# Altium project pdmlse_pcb.PrjPcb (part 4 of 4)

## Sheet Intel16_UNI3.SchDoc
size A4; SheetNumber: 7; SheetTotal: 15
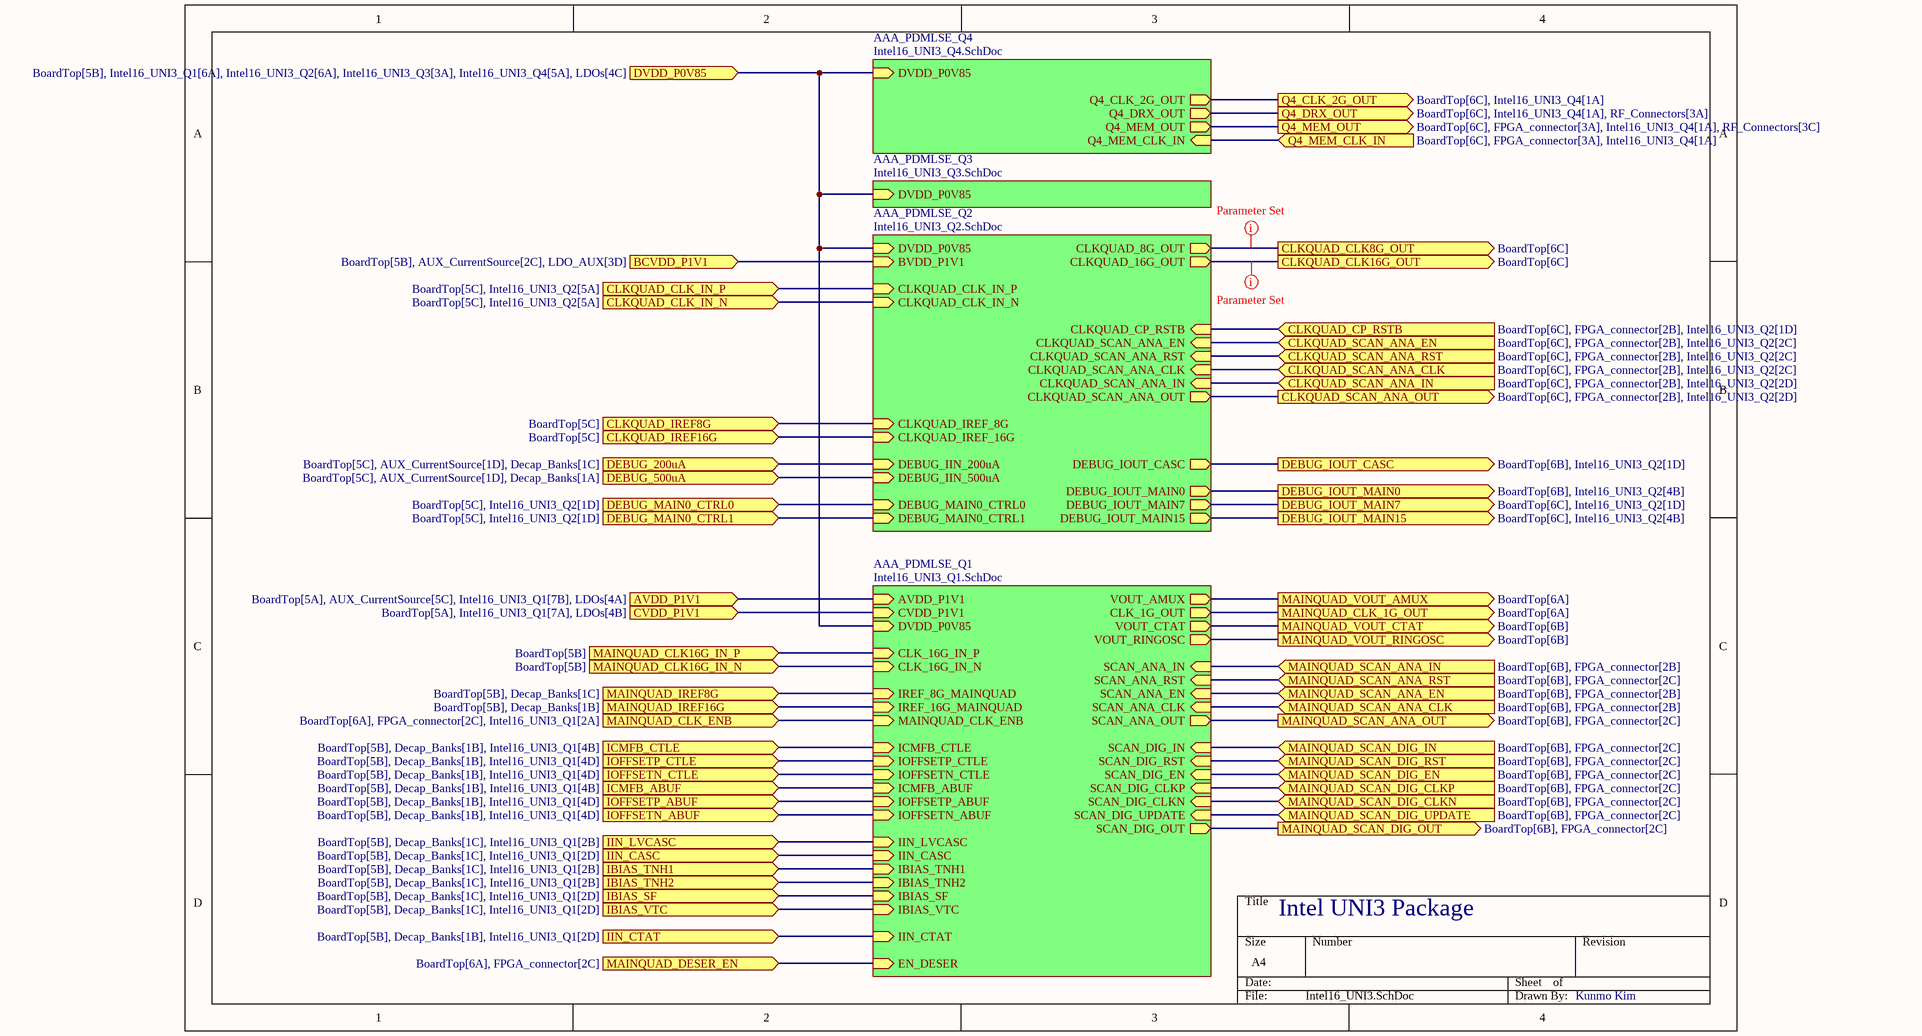
[diagram p8: Intel16_UNI3.SchDoc]

### Sub-sheets
AAA_PDMLSE_Q1 = Intel16_UNI3_Q1.SchDoc (file not in this document): CLK_16G_IN_P (in), DVDD_P0V85 (in), CVDD_P1V1 (in), CLK_16G_IN_N (in), MAINQUAD_CLK_ENB (in), IREF_8G_MAINQUAD (in), IREF_16G_MAINQUAD (in), IBIAS_TNH2 (in), ICMFB_ABUF (in), AVDD_P1V1 (in), IBIAS_TNH1 (in), ICMFB_CTLE (in), IIN_LVCASC (in), SCAN_DIG_OUT (out), SCAN_DIG_UPDATE (in), SCAN_DIG_EN (in), SCAN_DIG_RST (in), SCAN_DIG_CLKP (in), SCAN_DIG_CLKN (in), SCAN_DIG_IN (in), SCAN_ANA_OUT (out), SCAN_ANA_RST (in), SCAN_ANA_IN (in), SCAN_ANA_EN (in), SCAN_ANA_CLK (in), EN_DESER (in), VOUT_RINGOSC (out), IIN_CASC (in), CLK_1G_OUT (out), IIN_CTAT (in), VOUT_AMUX (out), VOUT_CTAT (out), IBIAS_SF (in), IOFFSETP_CTLE (in), IBIAS_VTC (in), IOFFSETN_CTLE (in), IOFFSETN_ABUF (in), IOFFSETP_ABUF (in)
AAA_PDMLSE_Q2 = Intel16_UNI3_Q2.SchDoc (file not in this document): DVDD_P0V85 (in), BVDD_P1V1 (in), CLKQUAD_8G_OUT (out), CLKQUAD_16G_OUT (out), CLKQUAD_CLK_IN_N (in), CLKQUAD_CLK_IN_P (in), CLKQUAD_SCAN_ANA_CLK (in), CLKQUAD_SCAN_ANA_RST (in), CLKQUAD_SCAN_ANA_EN (in), CLKQUAD_SCAN_ANA_OUT (out), CLKQUAD_SCAN_ANA_IN (in), CLKQUAD_IREF_8G (in), CLKQUAD_CP_RSTB (in), CLKQUAD_IREF_16G (in), DEBUG_IIN_200uA (in), DEBUG_IIN_500uA (in), DEBUG_MAIN0_CTRL0 (in), DEBUG_MAIN0_CTRL1 (in), DEBUG_IOUT_CASC (out), DEBUG_IOUT_MAIN7 (out), DEBUG_IOUT_MAIN15 (out), DEBUG_IOUT_MAIN0 (out)
AAA_PDMLSE_Q3 = Intel16_UNI3_Q3.SchDoc (file not in this document): DVDD_P0V85 (in)
AAA_PDMLSE_Q4 = Intel16_UNI3_Q4.SchDoc (file not in this document): DVDD_P0V85 (in), Q4_CLK_2G_OUT (out), Q4_DRX_OUT (out), Q4_MEM_OUT (out), Q4_MEM_CLK_IN (in)

### Ports
AVDD_P1V1 (in, see BoardTop[5A], AUX_CurrentSource[5C], Intel16_UNI3_Q1[7B], LDOs[4A]), BCVDD_P1V1 (in, see BoardTop[5B], AUX_CurrentSource[2C], LDO_AUX[3D]), CLKQUAD_CLK8G_OUT (out, see BoardTop[6C]), CLKQUAD_CLK16G_OUT (out, see BoardTop[6C]), CLKQUAD_CLK_IN_N (in, see BoardTop[5C], Intel16_UNI3_Q2[5A]), CLKQUAD_CLK_IN_P (in, see BoardTop[5C], Intel16_UNI3_Q2[5A]), CLKQUAD_CP_RSTB (in, see BoardTop[6C], FPGA_connector[2B], Intel16_UNI3_Q2[1D]), CLKQUAD_IREF8G (in, see BoardTop[5C]), CLKQUAD_IREF16G (in, see BoardTop[5C]), CLKQUAD_SCAN_ANA_CLK (in, see BoardTop[6C], FPGA_connector[2B], Intel16_UNI3_Q2[2C]), CLKQUAD_SCAN_ANA_EN (in, see BoardTop[6C], FPGA_connector[2B], Intel16_UNI3_Q2[2C]), CLKQUAD_SCAN_ANA_IN (in, see BoardTop[6C], FPGA_connector[2B], Intel16_UNI3_Q2[2D]), CLKQUAD_SCAN_ANA_OUT (out, see BoardTop[6C], FPGA_connector[2B], Intel16_UNI3_Q2[2D]), CLKQUAD_SCAN_ANA_RST (in, see BoardTop[6C], FPGA_connector[2B], Intel16_UNI3_Q2[2C]), CVDD_P1V1 (in, see BoardTop[5A], Intel16_UNI3_Q1[7A], LDOs[4B]), DEBUG_200uA (in, see BoardTop[5C], AUX_CurrentSource[1D], Decap_Banks[1C]), DEBUG_500uA (in, see BoardTop[5C], AUX_CurrentSource[1D], Decap_Banks[1A]), DEBUG_IOUT_CASC (out, see BoardTop[6B], Intel16_UNI3_Q2[1D]), DEBUG_IOUT_MAIN0 (out, see BoardTop[6B], Intel16_UNI3_Q2[4B]), DEBUG_IOUT_MAIN7 (out, see BoardTop[6C], Intel16_UNI3_Q2[1D]), DEBUG_IOUT_MAIN15 (out, see BoardTop[6C], Intel16_UNI3_Q2[4B]), DEBUG_MAIN0_CTRL0 (in, see BoardTop[5C], Intel16_UNI3_Q2[1D]), DEBUG_MAIN0_CTRL1 (in, see BoardTop[5C], Intel16_UNI3_Q2[1D]), DVDD_P0V85 (in, see BoardTop[5B], Intel16_UNI3_Q1[6A], Intel16_UNI3_Q2[6A], Intel16_UNI3_Q3[3A], Intel16_UNI3_Q4[5A], LDOs[4C]), IBIAS_SF (in, see BoardTop[5B], Decap_Banks[1C], Intel16_UNI3_Q1[2D]), IBIAS_TNH1 (in, see BoardTop[5B], Decap_Banks[1C], Intel16_UNI3_Q1[2B]), IBIAS_TNH2 (in, see BoardTop[5B], Decap_Banks[1C], Intel16_UNI3_Q1[2B]), IBIAS_VTC (in, see BoardTop[5B], Decap_Banks[1C], Intel16_UNI3_Q1[2D]), ICMFB_ABUF (in, see BoardTop[5B], Decap_Banks[1B], Intel16_UNI3_Q1[4B]), ICMFB_CTLE (in, see BoardTop[5B], Decap_Banks[1B], Intel16_UNI3_Q1[4B]), IIN_CASC (in, see BoardTop[5B], Decap_Banks[1C], Intel16_UNI3_Q1[2D]), IIN_CTAT (in, see BoardTop[5B], Decap_Banks[1B], Intel16_UNI3_Q1[2D]), IIN_LVCASC (in, see BoardTop[5B], Decap_Banks[1C], Intel16_UNI3_Q1[2B]), IOFFSETN_ABUF (in, see BoardTop[5B], Decap_Banks[1B], Intel16_UNI3_Q1[4D]), IOFFSETN_CTLE (in, see BoardTop[5B], Decap_Banks[1B], Intel16_UNI3_Q1[4D]), IOFFSETP_ABUF (in, see BoardTop[5B], Decap_Banks[1B], Intel16_UNI3_Q1[4D]), IOFFSETP_CTLE (in, see BoardTop[5B], Decap_Banks[1B], Intel16_UNI3_Q1[4D]), MAINQUAD_CLK16G_IN_N (in, see BoardTop[5B]), MAINQUAD_CLK16G_IN_P (in, see BoardTop[5B]), MAINQUAD_CLK_1G_OUT (out, see BoardTop[6A]), MAINQUAD_CLK_ENB (in, see BoardTop[6A], FPGA_connector[2C], Intel16_UNI3_Q1[2A]), MAINQUAD_DESER_EN (in, see BoardTop[6A], FPGA_connector[2C]), MAINQUAD_IREF8G (in, see BoardTop[5B], Decap_Banks[1C]), MAINQUAD_IREF16G (in, see BoardTop[5B], Decap_Banks[1B]), MAINQUAD_SCAN_ANA_CLK (in, see BoardTop[6B], FPGA_connector[2B]), MAINQUAD_SCAN_ANA_EN (in, see BoardTop[6B], FPGA_connector[2B]), MAINQUAD_SCAN_ANA_IN (in, see BoardTop[6B], FPGA_connector[2B]), MAINQUAD_SCAN_ANA_OUT (out, see BoardTop[6B], FPGA_connector[2C]), MAINQUAD_SCAN_ANA_RST (in, see BoardTop[6B], FPGA_connector[2C]), MAINQUAD_SCAN_DIG_CLKN (in, see BoardTop[6B], FPGA_connector[2C]), MAINQUAD_SCAN_DIG_CLKP (in, see BoardTop[6B], FPGA_connector[2C]), MAINQUAD_SCAN_DIG_EN (in, see BoardTop[6B], FPGA_connector[2C]), MAINQUAD_SCAN_DIG_IN (in, see BoardTop[6B], FPGA_connector[2C]), MAINQUAD_SCAN_DIG_OUT (out, see BoardTop[6B], FPGA_connector[2C]), MAINQUAD_SCAN_DIG_RST (in, see BoardTop[6B], FPGA_connector[2C]), MAINQUAD_SCAN_DIG_UPDATE (in, see BoardTop[6B], FPGA_connector[2C]), MAINQUAD_VOUT_AMUX (out, see BoardTop[6A]), MAINQUAD_VOUT_CTAT (out, see BoardTop[6B]), MAINQUAD_VOUT_RINGOSC (out, see BoardTop[6B]), Q4_CLK_2G_OUT (out, see BoardTop[6C], Intel16_UNI3_Q4[1A]), Q4_DRX_OUT (out, see BoardTop[6C], Intel16_UNI3_Q4[1A], RF_Connectors[3A]), Q4_MEM_CLK_IN (in, see BoardTop[6C], FPGA_connector[3A], Intel16_UNI3_Q4[1A]), Q4_MEM_OUT (out, see BoardTop[6C], FPGA_connector[3A], Intel16_UNI3_Q4[1A], RF_Connectors[3C])

### Nets
AVDD_P1V1: port AVDD_P1V1, sheet AAA_PDMLSE_Q1/AVDD_P1V1
CVDD_P1V1: port CVDD_P1V1, sheet AAA_PDMLSE_Q1/CVDD_P1V1
DVDD_P0V85: port DVDD_P0V85, sheet AAA_PDMLSE_Q4/DVDD_P0V85, sheet AAA_PDMLSE_Q3/DVDD_P0V85, sheet AAA_PDMLSE_Q1/DVDD_P0V85, sheet AAA_PDMLSE_Q2/DVDD_P0V85
BCVDD_P1V1: port BCVDD_P1V1, sheet AAA_PDMLSE_Q2/BVDD_P1V1
CLKQUAD_SCAN_ANA_CLK: port CLKQUAD_SCAN_ANA_CLK, sheet AAA_PDMLSE_Q2/CLKQUAD_SCAN_ANA_CLK
CLKQUAD_SCAN_ANA_EN: port CLKQUAD_SCAN_ANA_EN, sheet AAA_PDMLSE_Q2/CLKQUAD_SCAN_ANA_EN
CLKQUAD_SCAN_ANA_IN: port CLKQUAD_SCAN_ANA_IN, sheet AAA_PDMLSE_Q2/CLKQUAD_SCAN_ANA_IN
CLKQUAD_SCAN_ANA_OUT: port CLKQUAD_SCAN_ANA_OUT, sheet AAA_PDMLSE_Q2/CLKQUAD_SCAN_ANA_OUT
CLKQUAD_SCAN_ANA_RST: port CLKQUAD_SCAN_ANA_RST, sheet AAA_PDMLSE_Q2/CLKQUAD_SCAN_ANA_RST
DEBUG_200uA: port DEBUG_200uA, sheet AAA_PDMLSE_Q2/DEBUG_IIN_200uA
DEBUG_500uA: port DEBUG_500uA, sheet AAA_PDMLSE_Q2/DEBUG_IIN_500uA
DEBUG_MAIN0_CTRL0: port DEBUG_MAIN0_CTRL0, sheet AAA_PDMLSE_Q2/DEBUG_MAIN0_CTRL0
DEBUG_MAIN0_CTRL1: port DEBUG_MAIN0_CTRL1, sheet AAA_PDMLSE_Q2/DEBUG_MAIN0_CTRL1
EN_DESER: port MAINQUAD_DESER_EN, sheet AAA_PDMLSE_Q1/EN_DESER
ENB_CLK: port MAINQUAD_CLK_ENB, sheet AAA_PDMLSE_Q1/MAINQUAD_CLK_ENB
IBIAS_SF: port IBIAS_SF, sheet AAA_PDMLSE_Q1/IBIAS_SF
IBIAS_TNH1: port IBIAS_TNH1, sheet AAA_PDMLSE_Q1/IBIAS_TNH1
IBIAS_TNH2: port IBIAS_TNH2, sheet AAA_PDMLSE_Q1/IBIAS_TNH2
IBIAS_VTC: port IBIAS_VTC, sheet AAA_PDMLSE_Q1/IBIAS_VTC
ICMFB_ABUF: port ICMFB_ABUF, sheet AAA_PDMLSE_Q1/ICMFB_ABUF
ICMFB_CTLE: port ICMFB_CTLE, sheet AAA_PDMLSE_Q1/ICMFB_CTLE
IIN_CASC: port IIN_CASC, sheet AAA_PDMLSE_Q1/IIN_CASC
IIN_CTAT: port IIN_CTAT, sheet AAA_PDMLSE_Q1/IIN_CTAT
IIN_LVCASC: port IIN_LVCASC, sheet AAA_PDMLSE_Q1/IIN_LVCASC
IOFFSETN_ABUF: port IOFFSETN_ABUF, sheet AAA_PDMLSE_Q1/IOFFSETN_ABUF
IOFFSETN_CTLE: port IOFFSETN_CTLE, sheet AAA_PDMLSE_Q1/IOFFSETN_CTLE
IOFFSETP_ABUF: port IOFFSETP_ABUF, sheet AAA_PDMLSE_Q1/IOFFSETP_ABUF
IOFFSETP_CTLE: port IOFFSETP_CTLE, sheet AAA_PDMLSE_Q1/IOFFSETP_CTLE
MAINQUAD_IREF8G: port MAINQUAD_IREF8G, sheet AAA_PDMLSE_Q1/IREF_8G_MAINQUAD
MAINQUAD_IREF16G: port MAINQUAD_IREF16G, sheet AAA_PDMLSE_Q1/IREF_16G_MAINQUAD
MAINQUAD_SCAN_ANA_CLK: port MAINQUAD_SCAN_ANA_CLK, sheet AAA_PDMLSE_Q1/SCAN_ANA_CLK
MAINQUAD_SCAN_ANA_EN: port MAINQUAD_SCAN_ANA_EN, sheet AAA_PDMLSE_Q1/SCAN_ANA_EN
MAINQUAD_SCAN_ANA_IN: port MAINQUAD_SCAN_ANA_IN, sheet AAA_PDMLSE_Q1/SCAN_ANA_IN
MAINQUAD_SCAN_ANA_OUT: port MAINQUAD_SCAN_ANA_OUT, sheet AAA_PDMLSE_Q1/SCAN_ANA_OUT
MAINQUAD_SCAN_ANA_RST: port MAINQUAD_SCAN_ANA_RST, sheet AAA_PDMLSE_Q1/SCAN_ANA_RST
MAINQUAD_SCAN_DIG_CLKN: port MAINQUAD_SCAN_DIG_CLKN, sheet AAA_PDMLSE_Q1/SCAN_DIG_CLKN
MAINQUAD_SCAN_DIG_CLKP: port MAINQUAD_SCAN_DIG_CLKP, sheet AAA_PDMLSE_Q1/SCAN_DIG_CLKP
MAINQUAD_SCAN_DIG_EN: port MAINQUAD_SCAN_DIG_EN, sheet AAA_PDMLSE_Q1/SCAN_DIG_EN
MAINQUAD_SCAN_DIG_IN: port MAINQUAD_SCAN_DIG_IN, sheet AAA_PDMLSE_Q1/SCAN_DIG_IN
MAINQUAD_SCAN_DIG_OUT: port MAINQUAD_SCAN_DIG_OUT, sheet AAA_PDMLSE_Q1/SCAN_DIG_OUT
MAINQUAD_SCAN_DIG_RST: port MAINQUAD_SCAN_DIG_RST, sheet AAA_PDMLSE_Q1/SCAN_DIG_RST
MAINQUAD_SCAN_DIG_UPDATE: port MAINQUAD_SCAN_DIG_UPDATE, sheet AAA_PDMLSE_Q1/SCAN_DIG_UPDATE
Q4_CLK_2G_OUT: port Q4_CLK_2G_OUT, sheet AAA_PDMLSE_Q4/Q4_CLK_2G_OUT
Q4_DRX_OUT: port Q4_DRX_OUT, sheet AAA_PDMLSE_Q4/Q4_DRX_OUT
Q4_MEM_CLK: port Q4_MEM_CLK_IN, sheet AAA_PDMLSE_Q4/Q4_MEM_CLK_IN
Q4_MEM_OUT: port Q4_MEM_OUT, sheet AAA_PDMLSE_Q4/Q4_MEM_OUT
SIG_AMUX: port MAINQUAD_VOUT_AMUX, sheet AAA_PDMLSE_Q1/VOUT_AMUX
SIG_CTAT: port MAINQUAD_VOUT_CTAT, sheet AAA_PDMLSE_Q1/VOUT_CTAT
NetC1_0_1: port MAINQUAD_CLK_1G_OUT, sheet AAA_PDMLSE_Q1/CLK_1G_OUT
NetC2_0_1: port MAINQUAD_VOUT_RINGOSC, sheet AAA_PDMLSE_Q1/VOUT_RINGOSC
NetC3_0_2: port CLKQUAD_CLK8G_OUT, sheet AAA_PDMLSE_Q2/CLKQUAD_8G_OUT
NetC4_0_2: port CLKQUAD_CLK16G_OUT, sheet AAA_PDMLSE_Q2/CLKQUAD_16G_OUT
NetC_CLKN_AA_CLK_16G_2: port MAINQUAD_CLK16G_IN_N, sheet AAA_PDMLSE_Q1/CLK_16G_IN_N
NetC_CLKN_AA_CLKQUAD_16G_2: port CLKQUAD_CLK_IN_P, sheet AAA_PDMLSE_Q2/CLKQUAD_CLK_IN_P
NetC_CLKP_AA_CLK_16G_2: port MAINQUAD_CLK16G_IN_P, sheet AAA_PDMLSE_Q1/CLK_16G_IN_P
NetC_CLKP_AA_CLKQUAD_16G_2: port CLKQUAD_CLK_IN_N, sheet AAA_PDMLSE_Q2/CLKQUAD_CLK_IN_N
NetCR3_12_1: port CLKQUAD_CP_RSTB, sheet AAA_PDMLSE_Q2/CLKQUAD_CP_RSTB
NetR1_0_1: port DEBUG_IOUT_CASC, sheet AAA_PDMLSE_Q2/DEBUG_IOUT_CASC
NetR2_0_1: port DEBUG_IOUT_MAIN7, sheet AAA_PDMLSE_Q2/DEBUG_IOUT_MAIN7
NetR3_0_1: port DEBUG_IOUT_MAIN0, sheet AAA_PDMLSE_Q2/DEBUG_IOUT_MAIN0
NetR4_0_1: port DEBUG_IOUT_MAIN15, sheet AAA_PDMLSE_Q2/DEBUG_IOUT_MAIN15
NetR5_0_2: port CLKQUAD_IREF16G, sheet AAA_PDMLSE_Q2/CLKQUAD_IREF_16G
NetR6_0_2: port CLKQUAD_IREF8G, sheet AAA_PDMLSE_Q2/CLKQUAD_IREF_8G

### Layout directives
net class SC50_Ver2: NetC3_0_2, NetC4_0_2

### Notes on the sheet
- Intel UNI3 Package
- Kunmo Kim

## Sheet CLK_16GHz.SchDoc
size A4; SheetNumber: 6; SheetTotal: 15
Used 2 times, as channels AA_CLK_16G, AA_CLKQUAD_16G. Parts and nets are listed once, with the designators drawn on the sheet.
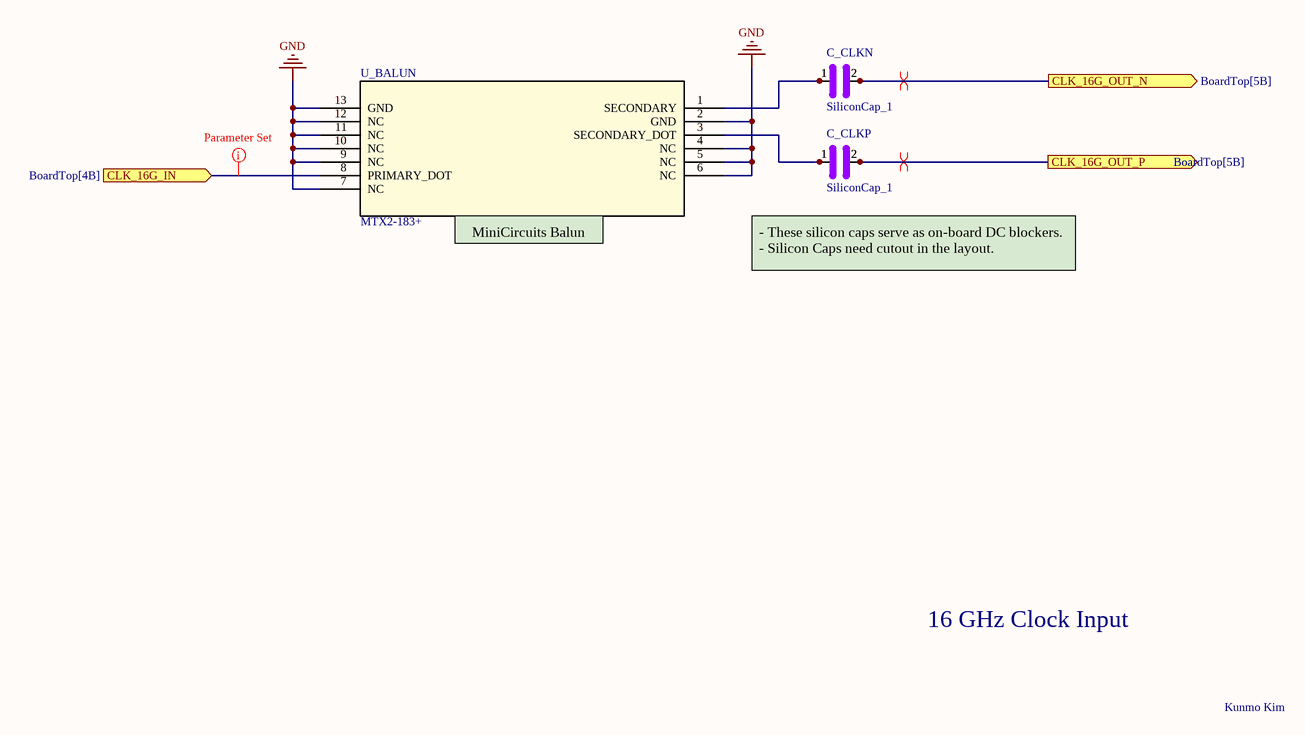
[diagram p9: CLK_16GHz.SchDoc]

### Parts
C_CLKN  SiliconCap_1  [0201-NOSILK]
C_CLKP  SiliconCap_1  [0201-NOSILK]
U_BALUN  MTX2-183+  [DG3006_MNC]

### Ports
CLK_16G_IN (in, see BoardTop[4B]), CLK_16G_OUT_N (out, see BoardTop[5B]), CLK_16G_OUT_P (out, see BoardTop[5B])

### Nets
GND: U_BALUN.2(GND) U_BALUN.4(NC) U_BALUN.5(NC) U_BALUN.6(NC) U_BALUN.7(NC) U_BALUN.9(NC) U_BALUN.10(NC) U_BALUN.11(NC) U_BALUN.12(NC) U_BALUN.13(GND)
CLK_16G_IN: U_BALUN.8(PRIMARY_DOT) ; port CLK_16G_IN
CLK_16G_OUT_N: C_CLKN.2 ; port CLK_16G_OUT_N
CLK_16G_OUT_P: C_CLKP.2 ; port CLK_16G_OUT_P
NetC_CLKN_1: C_CLKN.1 U_BALUN.1(SECONDARY)
NetC_CLKP_1: C_CLKP.1 U_BALUN.3(SECONDARY_DOT)

### Channels
AA_CLK_16G: designators end in _AA_CLK_16G; ports CLK_16G_IN=MAINQUAD_CLKIN CLK_16G_OUT_N=NetC_CLKN_AA_CLK_16G_2 CLK_16G_OUT_P=NetC_CLKP_AA_CLK_16G_2
AA_CLKQUAD_16G: designators end in _AA_CLKQUAD_16G; ports CLK_16G_IN=CLKQUAD_CLKIN CLK_16G_OUT_N=NetC_CLKN_AA_CLKQUAD_16G_2 CLK_16G_OUT_P=NetC_CLKP_AA_CLKQUAD_16G_2

### Layout directives
differential pair; differential pair class DIFF100; net class DIFF_CLK: NetC_CLKN_AA_CLK_16G_2, NetC_CLKP_AA_CLK_16G_2
net class SC50: MAINQUAD_CLKIN

### Notes on the sheet
- (near U_BALUN) MiniCircuits Balun
- - These silicon caps serve as on-board DC blockers.
  - Silicon Caps need cutout in the layout.
- 16 GHz Clock Input
- Kunmo Kim

### Library data of the parts
C_CLKN C_CLKP = SiliconCap_1: 939114492510-T3S from Murata; Supplier 1: Digikey; Supplier Part Number 1: 490-939114492510-T3SCT-ND
U_BALUN = MTX2-133+: Mfr_Name: Mini Circuits; RefDes: RefDes; Type: Type; Supplier 1: Mouser; Supplier Part Number 1: 139-MTX2-183+

## Sheet Decap_Banks.SchDoc
size A4; SheetNumber: 12; SheetTotal: 15
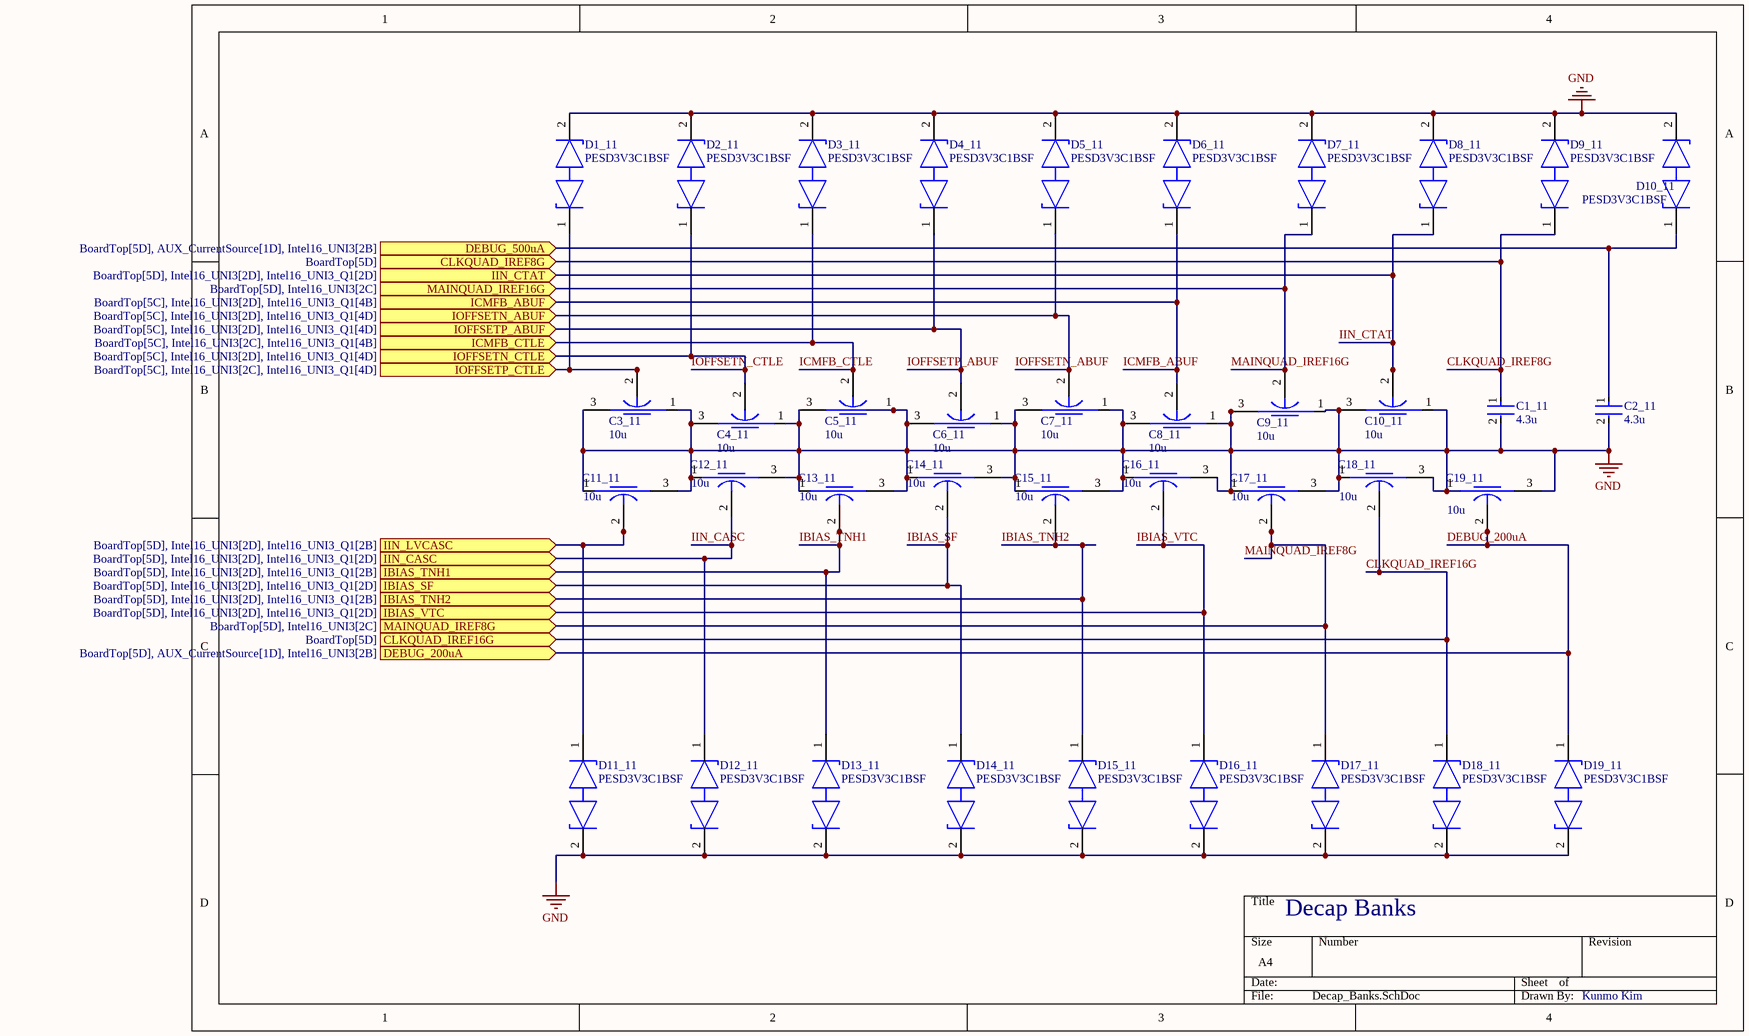
[diagram p10: Decap_Banks.SchDoc]

### Parts
C1_11  4.3u  [FP-LLL1U4-0_05-IPC_C]
C2_11  4.3u  [FP-LLL1U4-0_05-IPC_C]
C3_11  10u  [FP-NFM15-0_2-MFG]
C4_11  10u  [FP-NFM15-0_2-MFG]
C5_11  10u  [FP-NFM15-0_2-MFG]
C6_11  10u  [FP-NFM15-0_2-MFG]
C7_11  10u  [FP-NFM15-0_2-MFG]
C8_11  10u  [FP-NFM15-0_2-MFG]
C9_11  10u  [FP-NFM15-0_2-MFG]
C10_11  10u  [FP-NFM15-0_2-MFG]
C11_11  10u  [FP-NFM15-0_2-MFG]
C12_11  10u  [FP-NFM15-0_2-MFG]
C13_11  10u  [FP-NFM15-0_2-MFG]
C14_11  10u  [FP-NFM15-0_2-MFG]
C15_11  10u  [FP-NFM15-0_2-MFG]
C16_11  10u  [FP-NFM15-0_2-MFG]
C17_11  10u  [FP-NFM15-0_2-MFG]
C18_11  10u  [FP-NFM15-0_2-MFG]
C19_11  10u  [FP-NFM15-0_2-MFG]
D1_11  PESD3V3C1BSF  [FP-SOD962-2-MFG]
D2_11  PESD3V3C1BSF  [FP-SOD962-2-MFG]
D3_11  PESD3V3C1BSF  [FP-SOD962-2-MFG]
D4_11  PESD3V3C1BSF  [FP-SOD962-2-MFG]
D5_11  PESD3V3C1BSF  [FP-SOD962-2-MFG]
D6_11  PESD3V3C1BSF  [FP-SOD962-2-MFG]
D7_11  PESD3V3C1BSF  [FP-SOD962-2-MFG]
D8_11  PESD3V3C1BSF  [FP-SOD962-2-MFG]
D9_11  PESD3V3C1BSF  [FP-SOD962-2-MFG]
D10_11  PESD3V3C1BSF  [FP-SOD962-2-MFG]
D11_11  PESD3V3C1BSF  [FP-SOD962-2-MFG]
D12_11  PESD3V3C1BSF  [FP-SOD962-2-MFG]
D13_11  PESD3V3C1BSF  [FP-SOD962-2-MFG]
D14_11  PESD3V3C1BSF  [FP-SOD962-2-MFG]
D15_11  PESD3V3C1BSF  [FP-SOD962-2-MFG]
D16_11  PESD3V3C1BSF  [FP-SOD962-2-MFG]
D17_11  PESD3V3C1BSF  [FP-SOD962-2-MFG]
D18_11  PESD3V3C1BSF  [FP-SOD962-2-MFG]
D19_11  PESD3V3C1BSF  [FP-SOD962-2-MFG]

### Ports
CLKQUAD_IREF8G (in, see BoardTop[5D]), CLKQUAD_IREF16G (in, see BoardTop[5D]), DEBUG_200uA (in, see BoardTop[5D], AUX_CurrentSource[1D], Intel16_UNI3[2B]), DEBUG_500uA (in, see BoardTop[5D], AUX_CurrentSource[1D], Intel16_UNI3[2B]), IBIAS_SF (in, see BoardTop[5D], Intel16_UNI3[2D], Intel16_UNI3_Q1[2D]), IBIAS_TNH1 (in, see BoardTop[5D], Intel16_UNI3[2D], Intel16_UNI3_Q1[2B]), IBIAS_TNH2 (in, see BoardTop[5D], Intel16_UNI3[2D], Intel16_UNI3_Q1[2B]), IBIAS_VTC (in, see BoardTop[5D], Intel16_UNI3[2D], Intel16_UNI3_Q1[2D]), ICMFB_ABUF (in, see BoardTop[5C], Intel16_UNI3[2D], Intel16_UNI3_Q1[4B]), ICMFB_CTLE (in, see BoardTop[5C], Intel16_UNI3[2C], Intel16_UNI3_Q1[4B]), IIN_CASC (in, see BoardTop[5D], Intel16_UNI3[2D], Intel16_UNI3_Q1[2D]), IIN_CTAT (in, see BoardTop[5D], Intel16_UNI3[2D], Intel16_UNI3_Q1[2D]), IIN_LVCASC (in, see BoardTop[5D], Intel16_UNI3[2D], Intel16_UNI3_Q1[2B]), IOFFSETN_ABUF (in, see BoardTop[5C], Intel16_UNI3[2D], Intel16_UNI3_Q1[4D]), IOFFSETN_CTLE (in, see BoardTop[5C], Intel16_UNI3[2D], Intel16_UNI3_Q1[4D]), IOFFSETP_ABUF (in, see BoardTop[5C], Intel16_UNI3[2D], Intel16_UNI3_Q1[4D]), IOFFSETP_CTLE (in, see BoardTop[5C], Intel16_UNI3[2C], Intel16_UNI3_Q1[4D]), MAINQUAD_IREF8G (in, see BoardTop[5D], Intel16_UNI3[2C]), MAINQUAD_IREF16G (in, see BoardTop[5D], Intel16_UNI3[2C])

### Nets
GND: C1_11.2 C2_11.2 C3_11.1(Input) C3_11.3(Output) C4_11.1(Input) C4_11.3(Output) C5_11.1(Input) C5_11.3(Output) C6_11.1(Input) C6_11.3(Output) C7_11.1(Input) C7_11.3(Output) C8_11.1(Input) C8_11.3(Output) C9_11.1(Input) C9_11.3(Output) C10_11.1(Input) C10_11.3(Output) C11_11.1(Input) C11_11.3(Output) C12_11.1(Input) C12_11.3(Output) C13_11.1(Input) C13_11.3(Output) C14_11.1(Input) C14_11.3(Output) C15_11.1(Input) C15_11.3(Output) C16_11.1(Input) C16_11.3(Output) C17_11.1(Input) C17_11.3(Output) C18_11.1(Input) C18_11.3(Output) C19_11.1(Input) C19_11.3(Output) D1_11.2(K2) D2_11.2(K2) D3_11.2(K2) D4_11.2(K2) D5_11.2(K2) D6_11.2(K2) D7_11.2(K2) D8_11.2(K2) D9_11.2(K2) D10_11.2(K2) D11_11.2(K2) D12_11.2(K2) D13_11.2(K2) D14_11.2(K2) D15_11.2(K2) D16_11.2(K2) D17_11.2(K2) D18_11.2(K2) D19_11.2(K2)
CLKQUAD_IREF8G: C1_11.1 D9_11.1(K1) ; port CLKQUAD_IREF8G
CLKQUAD_IREF16G: C18_11.2(GND) D18_11.1(K1) ; port CLKQUAD_IREF16G
DEBUG_200uA: C19_11.2(GND) D19_11.1(K1) ; port DEBUG_200uA
DEBUG_500uA: C2_11.1 D10_11.1(K1) ; port DEBUG_500uA
IBIAS_SF: C14_11.2(GND) D14_11.1(K1) ; port IBIAS_SF
IBIAS_TNH1: C13_11.2(GND) D13_11.1(K1) ; port IBIAS_TNH1
IBIAS_TNH2: C15_11.2(GND) D15_11.1(K1) ; port IBIAS_TNH2
IBIAS_VTC: C16_11.2(GND) D16_11.1(K1) ; port IBIAS_VTC
ICMFB_ABUF: C8_11.2(GND) D6_11.1(K1) ; port ICMFB_ABUF
ICMFB_CTLE: C5_11.2(GND) D3_11.1(K1) ; port ICMFB_CTLE
IIN_CASC: C12_11.2(GND) D12_11.1(K1) ; port IIN_CASC
IIN_CTAT: C10_11.2(GND) D8_11.1(K1) ; port IIN_CTAT
IIN_LVCASC: C11_11.2(GND) D11_11.1(K1) ; port IIN_LVCASC
IOFFSETN_ABUF: C7_11.2(GND) D5_11.1(K1) ; port IOFFSETN_ABUF
IOFFSETN_CTLE: C4_11.2(GND) D2_11.1(K1) ; port IOFFSETN_CTLE
IOFFSETP_ABUF: C6_11.2(GND) D4_11.1(K1) ; port IOFFSETP_ABUF
IOFFSETP_CTLE: C3_11.2(GND) D1_11.1(K1) ; port IOFFSETP_CTLE
MAINQUAD_IREF8G: C17_11.2(GND) D17_11.1(K1) ; port MAINQUAD_IREF8G
MAINQUAD_IREF16G: C9_11.2(GND) D7_11.1(K1) ; port MAINQUAD_IREF16G

### Notes on the sheet
- Decap Banks
- Kunmo Kim

### Library data of the parts
C1_11 C2_11 = CMP-06035-061933-1: Cap Ceramic Monolithic 4.3uF 20% 4V X5R 15% 02404 (0610M); Capacitance: 4.3uF; Tolerance: 20%; Min Operating Temperature: -55°C; Case/Package: 0204; Voltage Rating: 4V; Mount: Surface Mount; Max Operating Temperature: 85°C; Packaging: Tape and Reel; RoHS Compliant: Yes
C3_11 C4_11 C5_11 C6_11 C7_11 C8_11 C9_11 C10_11 C11_11 C12_11 C13_11 C14_11 C15_11 C16_11 C17_11 C18_11 C19_11 = CMP-06053-000058-1: CAP FEEDTHRU
D1_11 D2_11 D3_11 D4_11 D5_11 D6_11 D7_11 D8_11 D9_11 D10_11 D11_11 D12_11 D13_11 D14_11 D15_11 D16_11 D17_11 D18_11 D19_11 = CMP-14436-000022-1: TVS DIODE 2VWM 3VC DSN0603-2

## Sheet FPGA_connector.SchDoc
size A3; SheetNumber: 13; SheetTotal: 15
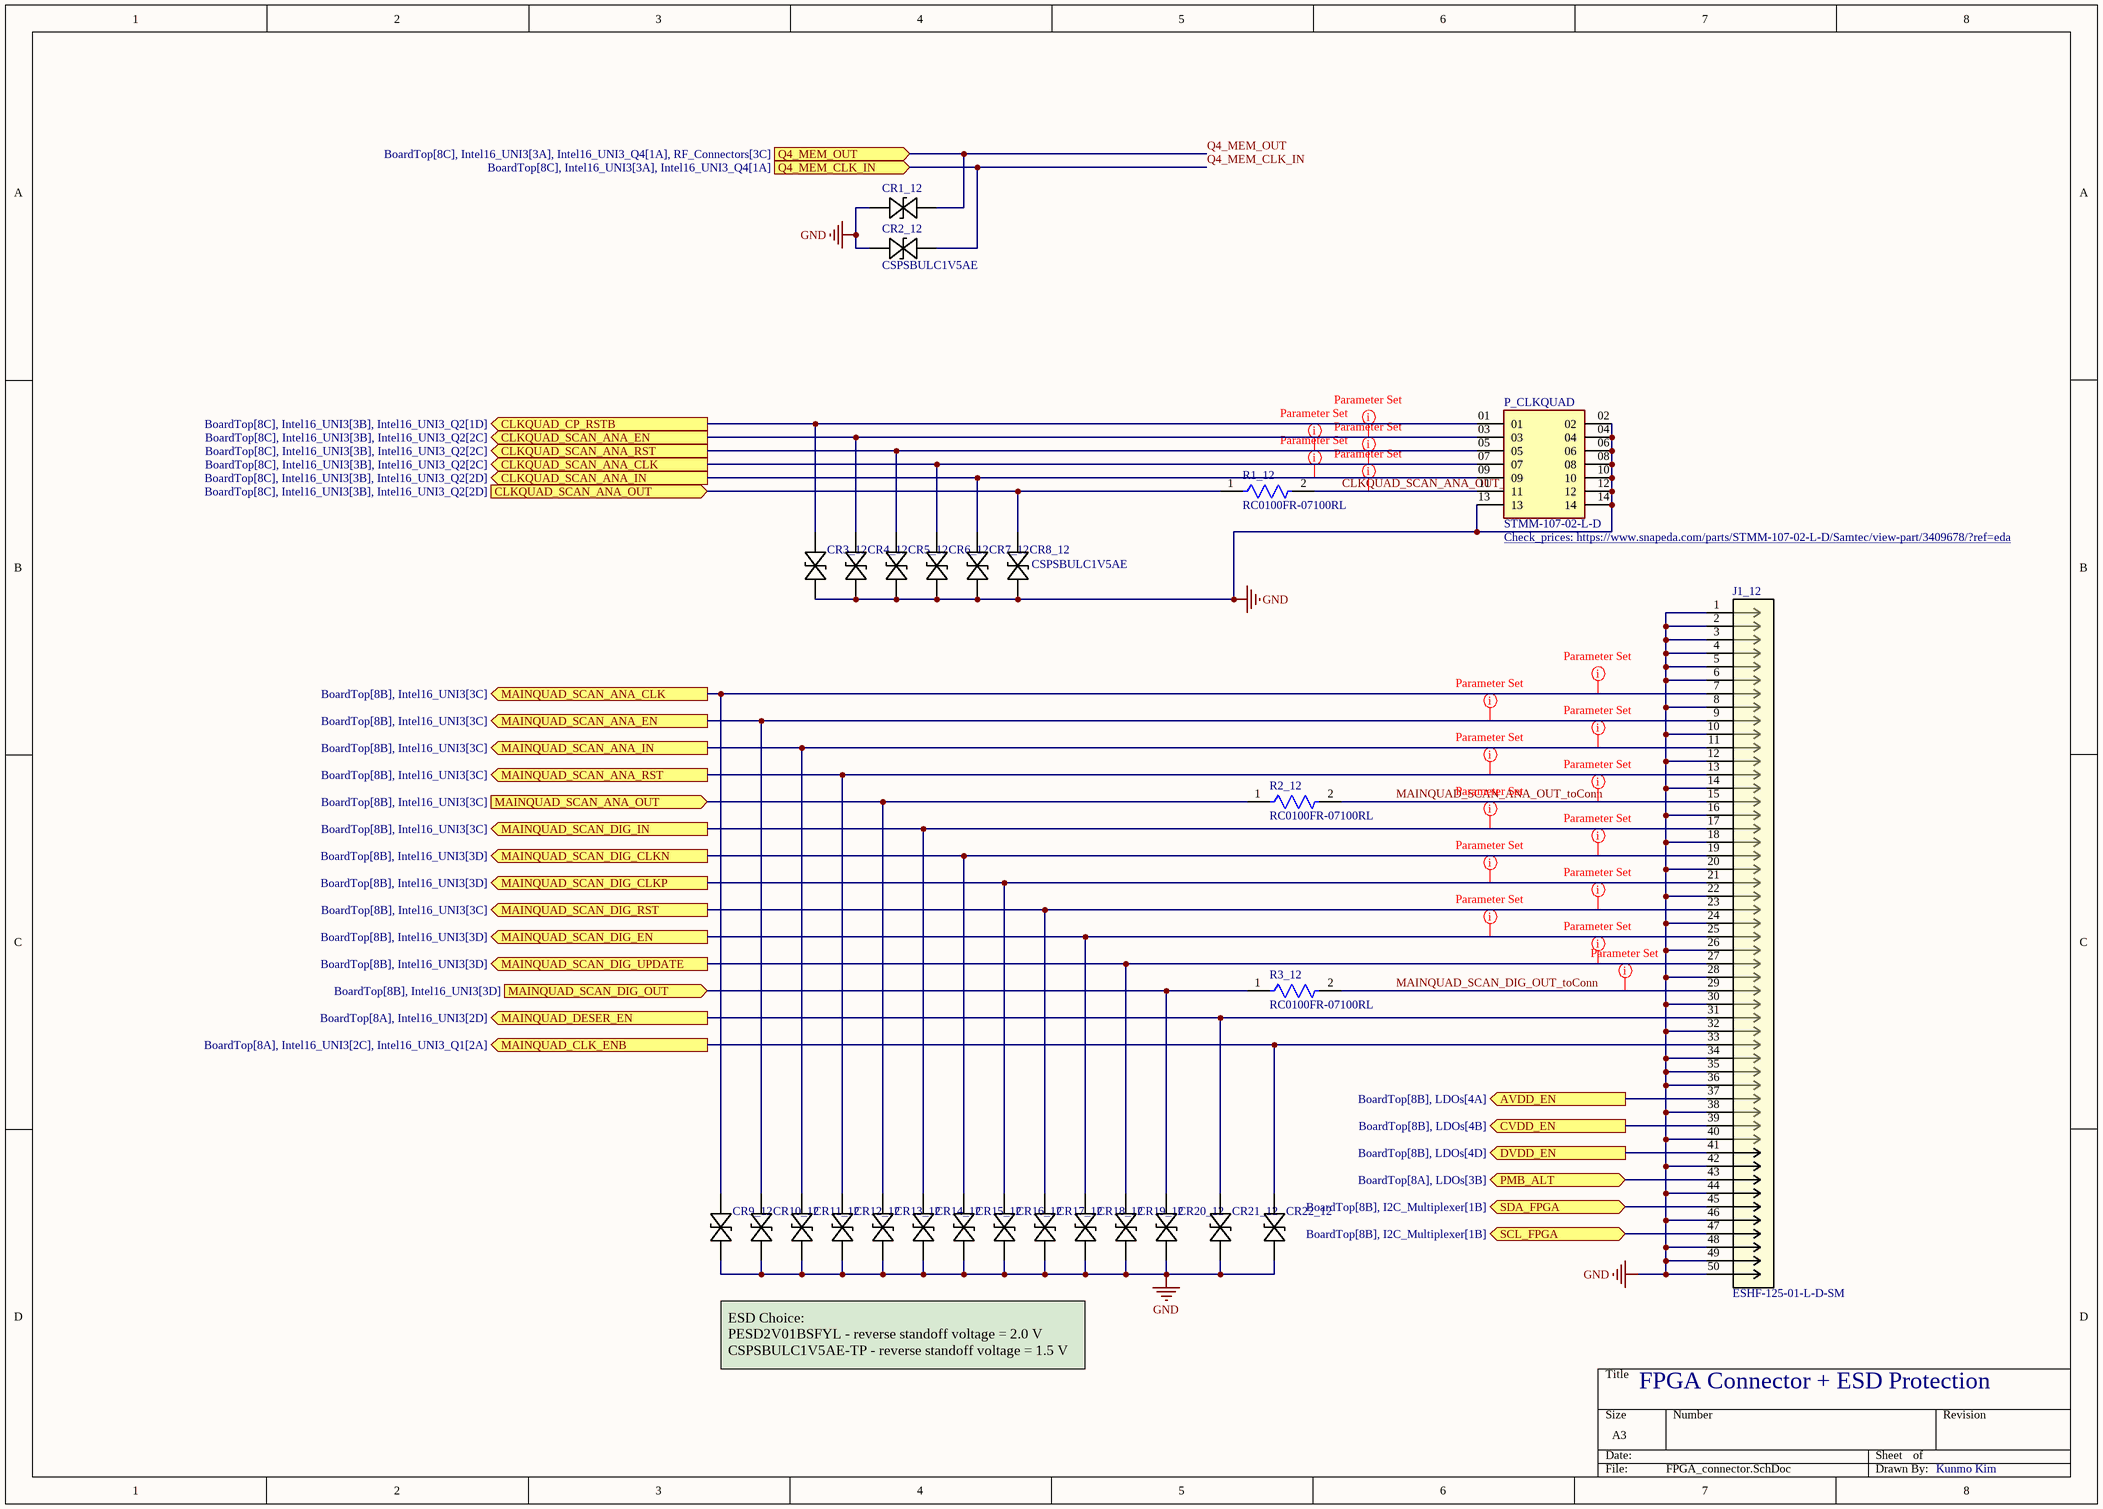
[diagram p11: FPGA_connector.SchDoc]

### Parts
CR1_12  CSPSBULC1V5AE  [WLL-2-1_INF]  (value not drawn)
CR2_12  CSPSBULC1V5AE  [WLL-2-1_INF]
CR3_12  CSPSBULC1V5AE  [WLL-2-1_INF]  (value not drawn)
CR4_12  CSPSBULC1V5AE  [WLL-2-1_INF]  (value not drawn)
CR5_12  CSPSBULC1V5AE  [WLL-2-1_INF]  (value not drawn)
CR6_12  CSPSBULC1V5AE  [WLL-2-1_INF]  (value not drawn)
CR7_12  CSPSBULC1V5AE  [WLL-2-1_INF]  (value not drawn)
CR8_12  CSPSBULC1V5AE  [WLL-2-1_INF]
CR9_12  CSPSBULC1V5AE  [WLL-2-1_INF]  (value not drawn)
CR10_12  CSPSBULC1V5AE  [WLL-2-1_INF]  (value not drawn)
CR11_12  CSPSBULC1V5AE  [WLL-2-1_INF]  (value not drawn)
CR12_12  CSPSBULC1V5AE  [WLL-2-1_INF]  (value not drawn)
CR13_12  CSPSBULC1V5AE  [WLL-2-1_INF]  (value not drawn)
CR14_12  CSPSBULC1V5AE  [WLL-2-1_INF]  (value not drawn)
CR15_12  CSPSBULC1V5AE  [WLL-2-1_INF]  (value not drawn)
CR16_12  CSPSBULC1V5AE  [WLL-2-1_INF]  (value not drawn)
CR17_12  CSPSBULC1V5AE  [WLL-2-1_INF]  (value not drawn)
CR18_12  CSPSBULC1V5AE  [WLL-2-1_INF]  (value not drawn)
CR19_12  CSPSBULC1V5AE  [WLL-2-1_INF]  (value not drawn)
CR20_12  CSPSBULC1V5AE  [WLL-2-1_INF]  (value not drawn)
CR21_12  CSPSBULC1V5AE  [WLL-2-1_INF]  (value not drawn)
CR22_12  CSPSBULC1V5AE  [WLL-2-1_INF]  (value not drawn)
J1_12  ESHF-125-01-L-D-SM  [CONN_ESHF-125-01-x-D-SM_SAI]
P_CLKQUAD  STMM-107-02-L-D  [SAMTEC_STMM-107-02-L-D]
R1_12  RC0100FR-07100RL  [FP-RC0100-0_15-MFG]
R2_12  RC0100FR-07100RL  [FP-RC0100-0_15-MFG]
R3_12  RC0100FR-07100RL  [FP-RC0100-0_15-MFG]

### Ports
AVDD_EN (out, see BoardTop[8B], LDOs[4A]), CLKQUAD_CP_RSTB (out, see BoardTop[8C], Intel16_UNI3[3B], Intel16_UNI3_Q2[1D]), CLKQUAD_SCAN_ANA_CLK (out, see BoardTop[8C], Intel16_UNI3[3B], Intel16_UNI3_Q2[2C]), CLKQUAD_SCAN_ANA_EN (out, see BoardTop[8C], Intel16_UNI3[3B], Intel16_UNI3_Q2[2C]), CLKQUAD_SCAN_ANA_IN (out, see BoardTop[8C], Intel16_UNI3[3B], Intel16_UNI3_Q2[2D]), CLKQUAD_SCAN_ANA_OUT (in, see BoardTop[8C], Intel16_UNI3[3B], Intel16_UNI3_Q2[2D]), CLKQUAD_SCAN_ANA_RST (out, see BoardTop[8C], Intel16_UNI3[3B], Intel16_UNI3_Q2[2C]), CVDD_EN (out, see BoardTop[8B], LDOs[4B]), DVDD_EN (out, see BoardTop[8B], LDOs[4D]), MAINQUAD_CLK_ENB (out, see BoardTop[8A], Intel16_UNI3[2C], Intel16_UNI3_Q1[2A]), MAINQUAD_DESER_EN (out, see BoardTop[8A], Intel16_UNI3[2D]), MAINQUAD_SCAN_ANA_CLK (out, see BoardTop[8B], Intel16_UNI3[3C]), MAINQUAD_SCAN_ANA_EN (out, see BoardTop[8B], Intel16_UNI3[3C]), MAINQUAD_SCAN_ANA_IN (out, see BoardTop[8B], Intel16_UNI3[3C]), MAINQUAD_SCAN_ANA_OUT (in, see BoardTop[8B], Intel16_UNI3[3C]), MAINQUAD_SCAN_ANA_RST (out, see BoardTop[8B], Intel16_UNI3[3C]), MAINQUAD_SCAN_DIG_CLKN (out, see BoardTop[8B], Intel16_UNI3[3D]), MAINQUAD_SCAN_DIG_CLKP (out, see BoardTop[8B], Intel16_UNI3[3D]), MAINQUAD_SCAN_DIG_EN (out, see BoardTop[8B], Intel16_UNI3[3D]), MAINQUAD_SCAN_DIG_IN (out, see BoardTop[8B], Intel16_UNI3[3C]), MAINQUAD_SCAN_DIG_OUT (in, see BoardTop[8B], Intel16_UNI3[3D]), MAINQUAD_SCAN_DIG_RST (out, see BoardTop[8B], Intel16_UNI3[3C]), MAINQUAD_SCAN_DIG_UPDATE (out, see BoardTop[8B], Intel16_UNI3[3D]), PMB_ALT (bidir, see BoardTop[8A], LDOs[3B]), Q4_MEM_CLK_IN (in, see BoardTop[8C], Intel16_UNI3[3A], Intel16_UNI3_Q4[1A]), Q4_MEM_OUT (in, see BoardTop[8C], Intel16_UNI3[3A], Intel16_UNI3_Q4[1A], RF_Connectors[3C]), SCL_FPGA (bidir, see BoardTop[8B], I2C_Multiplexer[1B]), SDA_FPGA (bidir, see BoardTop[8B], I2C_Multiplexer[1B])

### Nets
GND: CR1_12.1 CR2_12.1 CR3_12.2 CR4_12.2 CR5_12.2 CR6_12.2 CR7_12.2 CR8_12.2 CR9_12.2 CR10_12.2 CR11_12.2 CR12_12.2 CR13_12.2 CR14_12.2 CR15_12.2 CR16_12.2 CR17_12.2 CR18_12.2 CR19_12.2 CR20_12.2 CR21_12.2 CR22_12.2 J1_12.1 J1_12.2 J1_12.3 J1_12.4 J1_12.5 J1_12.6 J1_12.8 J1_12.10 J1_12.12 J1_12.14 J1_12.16 J1_12.18 J1_12.20 J1_12.22 J1_12.24 J1_12.26 J1_12.28 J1_12.30 J1_12.32 J1_12.34 J1_12.35 J1_12.36 J1_12.38 J1_12.40 J1_12.42 J1_12.44 J1_12.46 J1_12.48 J1_12.49 J1_12.50 P_CLKQUAD.02 P_CLKQUAD.04 P_CLKQUAD.06 P_CLKQUAD.08 P_CLKQUAD.10 P_CLKQUAD.12 P_CLKQUAD.13 P_CLKQUAD.14
AVDD_EN: J1_12.37 ; port AVDD_EN
CLKQUAD_SCAN_ANA_CLK: CR6_12.1 P_CLKQUAD.07 ; port CLKQUAD_SCAN_ANA_CLK
CLKQUAD_SCAN_ANA_EN: CR4_12.1 P_CLKQUAD.03 ; port CLKQUAD_SCAN_ANA_EN
CLKQUAD_SCAN_ANA_IN: CR7_12.1 P_CLKQUAD.09 ; port CLKQUAD_SCAN_ANA_IN
CLKQUAD_SCAN_ANA_OUT: CR8_12.1 R1_12.1 ; port CLKQUAD_SCAN_ANA_OUT
CLKQUAD_SCAN_ANA_OUT_toConn: P_CLKQUAD.11 R1_12.2
CLKQUAD_SCAN_ANA_RST: CR5_12.1 P_CLKQUAD.05 ; port CLKQUAD_SCAN_ANA_RST
CVDD_EN: J1_12.39 ; port CVDD_EN
DVDD_EN: J1_12.41 ; port DVDD_EN
EN_DESER: CR21_12.1 J1_12.31 ; port MAINQUAD_DESER_EN
ENB_CLK: CR22_12.1 J1_12.33 ; port MAINQUAD_CLK_ENB
MAINQUAD_SCAN_ANA_CLK: CR9_12.1 J1_12.7 ; port MAINQUAD_SCAN_ANA_CLK
MAINQUAD_SCAN_ANA_EN: CR10_12.1 J1_12.9 ; port MAINQUAD_SCAN_ANA_EN
MAINQUAD_SCAN_ANA_IN: CR11_12.1 J1_12.11 ; port MAINQUAD_SCAN_ANA_IN
MAINQUAD_SCAN_ANA_OUT: CR13_12.1 R2_12.1 ; port MAINQUAD_SCAN_ANA_OUT
MAINQUAD_SCAN_ANA_OUT_toConn: J1_12.15 R2_12.2
MAINQUAD_SCAN_ANA_RST: CR12_12.1 J1_12.13 ; port MAINQUAD_SCAN_ANA_RST
MAINQUAD_SCAN_DIG_CLKN: CR15_12.1 J1_12.19 ; port MAINQUAD_SCAN_DIG_CLKN
MAINQUAD_SCAN_DIG_CLKP: CR16_12.1 J1_12.21 ; port MAINQUAD_SCAN_DIG_CLKP
MAINQUAD_SCAN_DIG_EN: CR18_12.1 J1_12.25 ; port MAINQUAD_SCAN_DIG_EN
MAINQUAD_SCAN_DIG_IN: CR14_12.1 J1_12.17 ; port MAINQUAD_SCAN_DIG_IN
MAINQUAD_SCAN_DIG_OUT: CR20_12.1 R3_12.1 ; port MAINQUAD_SCAN_DIG_OUT
MAINQUAD_SCAN_DIG_OUT_toConn: J1_12.29 R3_12.2
MAINQUAD_SCAN_DIG_RST: CR17_12.1 J1_12.23 ; port MAINQUAD_SCAN_DIG_RST
MAINQUAD_SCAN_DIG_UPDATE: CR19_12.1 J1_12.27 ; port MAINQUAD_SCAN_DIG_UPDATE
PMB_ALT: J1_12.43 ; port PMB_ALT
Q4_MEM_CLK_IN: CR2_12.2 ; port Q4_MEM_CLK_IN  [project net Q4_MEM_CLK]
Q4_MEM_OUT: CR1_12.2 ; port Q4_MEM_OUT
SCL_FPGA: J1_12.47 ; port SCL_FPGA
SDA_FPGA: J1_12.45 ; port SDA_FPGA
NetCR3_12_1: CR3_12.1 P_CLKQUAD.01 ; port CLKQUAD_CP_RSTB

### Layout directives
net class CLKQUAD_SCAN_ANA: CLKQUAD_SCAN_ANA_CLK, CLKQUAD_SCAN_ANA_EN, CLKQUAD_SCAN_ANA_IN, CLKQUAD_SCAN_ANA_OUT_toConn, CLKQUAD_SCAN_ANA_RST
net class MAINQUAD_SCAN_ANA: MAINQUAD_SCAN_ANA_CLK, MAINQUAD_SCAN_ANA_EN, MAINQUAD_SCAN_ANA_IN, MAINQUAD_SCAN_ANA_OUT_toConn, MAINQUAD_SCAN_ANA_RST
net class MAINQUAD_SCAN_DIG: MAINQUAD_SCAN_DIG_CLKN, MAINQUAD_SCAN_DIG_CLKP, MAINQUAD_SCAN_DIG_EN, MAINQUAD_SCAN_DIG_IN, MAINQUAD_SCAN_DIG_OUT_toConn, MAINQUAD_SCAN_DIG_RST, MAINQUAD_SCAN_DIG_UPDATE

### Notes on the sheet
- ESD Choice:
  PESD2V01BSFYL - reverse standoff voltage = 2.0 V
  CSPSBULC1V5AE-TP - reverse standoff voltage = 1.5 V
- FPGA Connector + ESD Protection
- Kunmo Kim

### Library data of the parts
CR1_12 CR2_12 CR3_12 CR4_12 CR5_12 CR6_12 CR7_12 CR8_12 CR9_12 CR10_12 CR11_12 CR12_12 CR13_12 CR14_12 CR15_12 CR16_12 CR17_12 CR18_12 CR19_12 CR20_12 CR21_12 CR22_12 = ESD108B1CSP0201XTSA1: No Description Available; Mfr_Name: Infineon
J1_12 = ESHF-125-01-L-D-SM: No Description Available; Mfr_Name: Samtec Inc; Type: Headers, Male Pins; RefDes: RefDes; Supplier 1: Digikey; Supplier Part Number 1: SAM15560-ND; ClassName: InputPowerComponent
P_CLKQUAD = STMM-107-02-L-D: Connector Header Surface Mount 14 position 0.079 (2.00mm); MF: Samtec; MP: STMM-107-02-L-D; SnapEDA_Link: https://www.snapeda.com/parts/STMM-107-02-L-D/Samtec/view-part/3409678/?ref=snap; Package: None; Value: *; Digi-Key_Part_Number: STMM-107-02-L-D-SM-TR-ND; Supplier 1: Mouser; Supplier Part Number 1: 200-STMM10702LD; Check_prices: https://www.snapeda.com/parts/STMM-107-02-L-D/Samtec/view-part/3409678/?ref=eda
R1_12 R2_12 R3_12 = yageo_100ohm: RES SMD 100 OHM 1% 1/32W 01005; Resistance: 113R; Max Power Dissipation: 30mW; Temperature Coefficient: 200ppm/°C; Length: 0.016inch; Resistor Type: Thick Film; Tolerance: 1%; Height: 0.006inch; RoHS Compliant: Yes; Case Code (Imperial): 1005; Width: 0.008inch; Packaging: Tape and Reel; Case Code (Metric): 0402; Min Operating Temperature: -55°C; Max Operating Temperature: 125°C; Features: Moisture Resistant; Number of Terminations: 2; Supplier 1: Digikey; Supplier Part Number 1: 311-100DGCT-ND

## Sheet I2C_Multiplexer.SchDoc
size A4; SheetNumber: 14; SheetTotal: 15
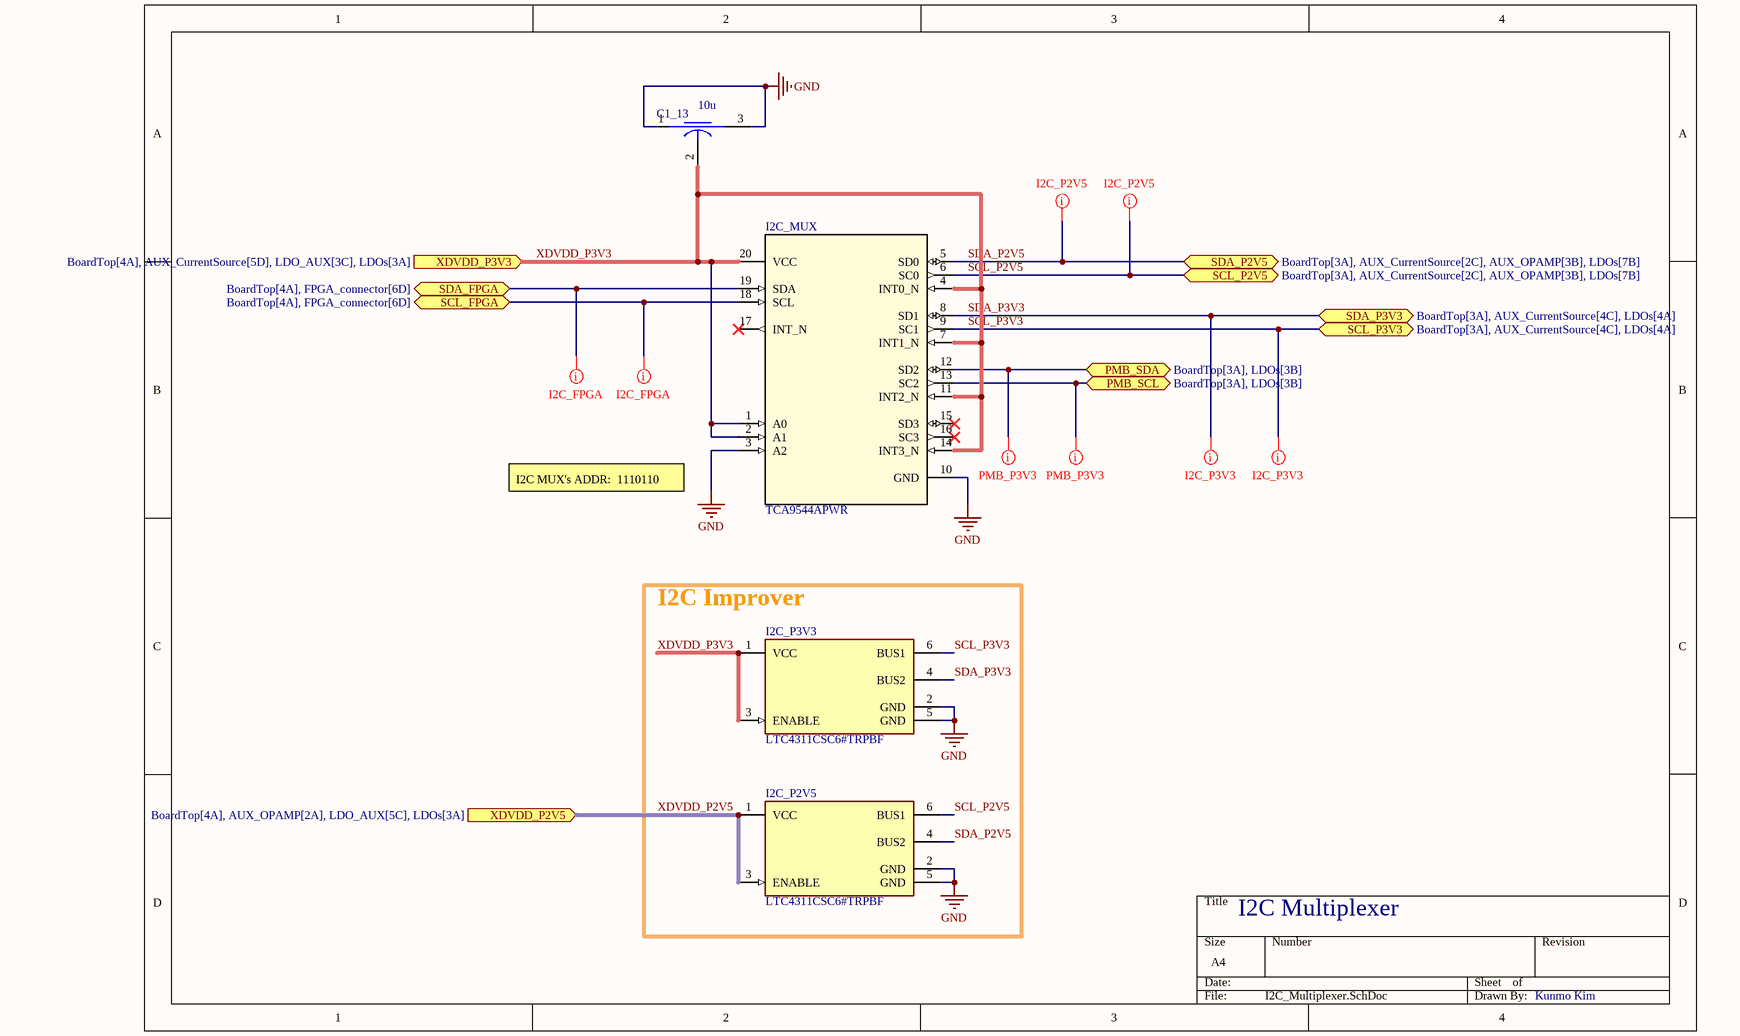
[diagram p12: I2C_Multiplexer.SchDoc]

### Parts
C1_13  10u  [FP-NFM15-0_2-MFG]
I2C_MUX  TCA9544APWR  [PW0020A_L]
I2C_P2V5  LTC4311CSC6#TRPBF  [FP-SC6-6-05-08-1638-IPC_B]
I2C_P3V3  LTC4311CSC6#TRPBF  [FP-SC6-6-05-08-1638-IPC_B]

### Blocks framed on the sheet
I2C Improver: I2C_P2V5 I2C_P3V3

### Ports
PMB_SCL (bidir, see BoardTop[3A], LDOs[3B]), PMB_SDA (bidir, see BoardTop[3A], LDOs[3B]), SCL_FPGA (bidir, see BoardTop[4A], FPGA_connector[6D]), SCL_P2V5 (bidir, see BoardTop[3A], AUX_CurrentSource[2C], AUX_OPAMP[3B], LDOs[7B]), SCL_P3V3 (bidir, see BoardTop[3A], AUX_CurrentSource[4C], LDOs[4A]), SDA_FPGA (bidir, see BoardTop[4A], FPGA_connector[6D]), SDA_P2V5 (bidir, see BoardTop[3A], AUX_CurrentSource[2C], AUX_OPAMP[3B], LDOs[7B]), SDA_P3V3 (bidir, see BoardTop[3A], AUX_CurrentSource[4C], LDOs[4A]), XDVDD_P2V5 (in, see BoardTop[4A], AUX_OPAMP[2A], LDO_AUX[5C], LDOs[3A]), XDVDD_P3V3 (in, see BoardTop[4A], AUX_CurrentSource[5D], LDO_AUX[3C], LDOs[3A])

### Nets
GND: C1_13.1(Input) C1_13.3(Output) I2C_MUX.3(A2) I2C_MUX.10(GND) I2C_P2V5.2(GND) I2C_P2V5.5(GND) I2C_P3V3.2(GND) I2C_P3V3.5(GND)
XDVDD_P2V5: I2C_P2V5.1(VCC) I2C_P2V5.3(ENABLE) ; port XDVDD_P2V5
XDVDD_P3V3: C1_13.2(GND) I2C_MUX.1(A0) I2C_MUX.2(A1) I2C_MUX.4(INT0_N) I2C_MUX.7(INT1_N) I2C_MUX.11(INT2_N) I2C_MUX.14(INT3_N) I2C_MUX.20(VCC) I2C_P3V3.1(VCC) I2C_P3V3.3(ENABLE) ; port XDVDD_P3V3
PMB_SCL: I2C_MUX.13(SC2) ; port PMB_SCL
PMB_SDA: I2C_MUX.12(SD2) ; port PMB_SDA
SCL_FPGA: I2C_MUX.18(SCL) ; port SCL_FPGA
SCL_P2V5: I2C_MUX.6(SC0) I2C_P2V5.6(BUS1) ; port SCL_P2V5
SCL_P3V3: I2C_MUX.9(SC1) I2C_P3V3.6(BUS1) ; port SCL_P3V3
SDA_FPGA: I2C_MUX.19(SDA) ; port SDA_FPGA
SDA_P2V5: I2C_MUX.5(SD0) I2C_P2V5.4(BUS2) ; port SDA_P2V5
SDA_P3V3: I2C_MUX.8(SD1) I2C_P3V3.4(BUS2) ; port SDA_P3V3

Not connected (* = marked no-connect by the designer): I2C_MUX 15(SD3)* 16(SC3)* 17(INT_N)*

### Layout directives
net class I2C_P2V5: SCL_P2V5, SDA_P2V5
net class I2C_P3V3: SCL_P3V3, SDA_P3V3
net class PMB_P3V3: PMB_SCL, PMB_SDA
net class I2C_FPGA: SCL_FPGA, SDA_FPGA

### Notes on the sheet
- I2C MUX's ADDR:  1110110
- I2C Multiplexer
- Kunmo Kim

### Library data of the parts
C1_13 = CMP-06053-000058-1: CAP FEEDTHRU
I2C_MUX = TCA9544APWR: No Description Available; Mfr_Name: Texas Instruments; CompType: IC; TYPE: TYPE; RefDes: RefDes; SymbolVerison: 2015-05-04; PartNumber: TCA9544APWR; PackageReference: PW0020A; MountType: SMT; RoHS: Y; Manufacturer: Texas Instruments
I2C_P2V5 I2C_P3V3 = CMP-09093-000026-1: IC POWER MANAGEMENT; Operating Supply Current: 300uA; Case/Package: SC; Min Operating Temperature: 0°C; Max Operating Temperature: 70°C; RoHS Compliant: Yes; Series: -; Number of Pins: 70; Package Quantity: 2500; Radiation Hardening: No; Mount: Surface Mount; Packaging: Tape and Reel

## Sheet RF_Connectors.SchDoc
size A; SheetNumber: 15; SheetTotal: 15
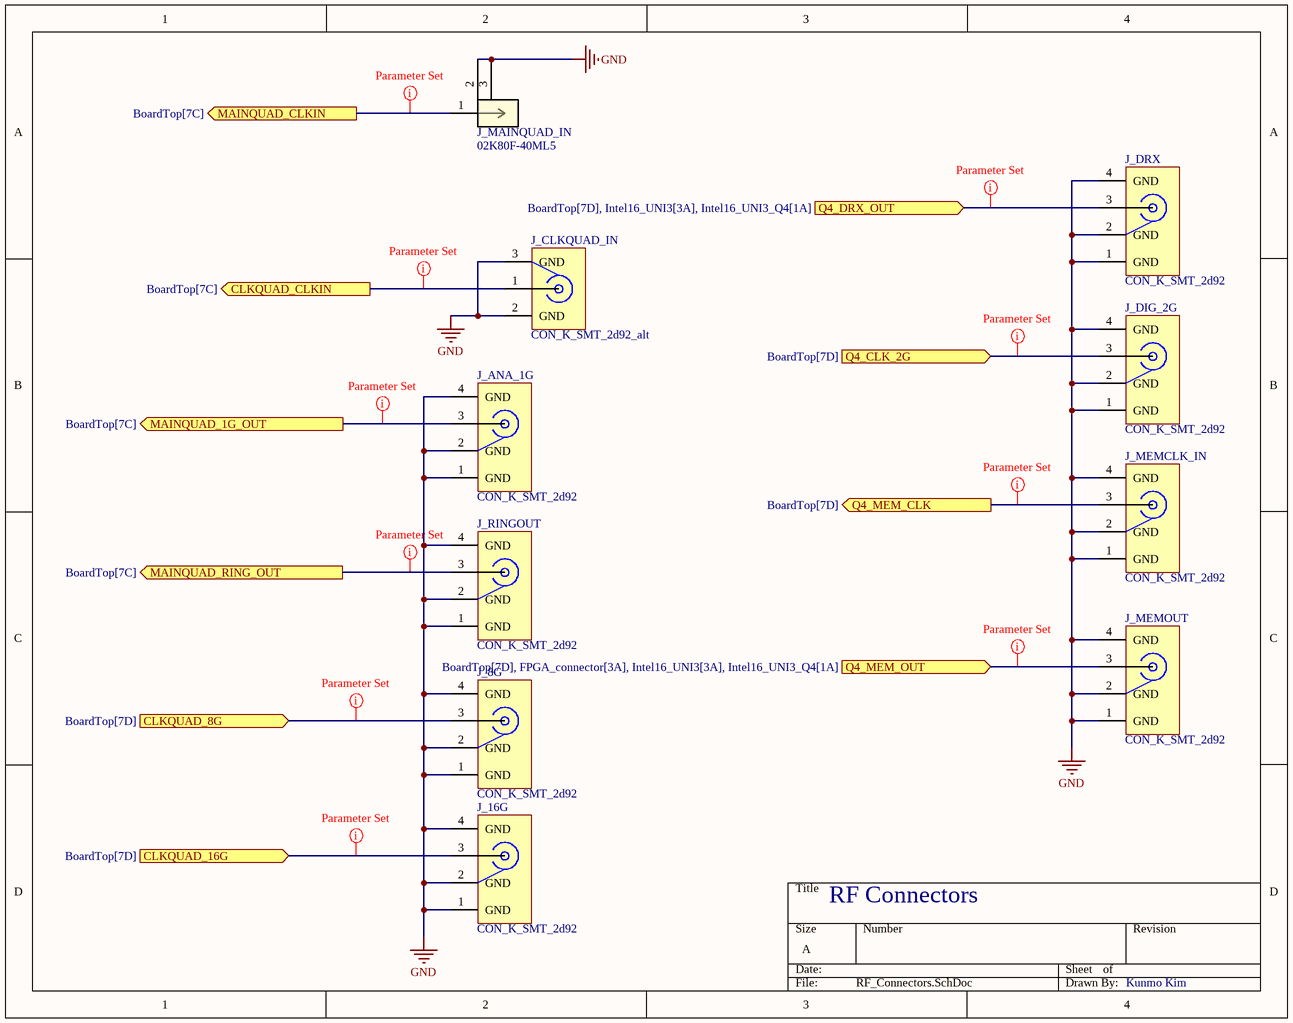
[diagram p13: RF_Connectors.SchDoc]

### Parts
J_8G  CON_K_SMT_2d92  [CON_K_SMT_2D92_3]
J_16G  CON_K_SMT_2d92  [CON_K_SMT_2D92_3]
J_ANA_1G  CON_K_SMT_2d92  [CON_K_SMT_2D92_3]
J_CLKQUAD_IN  CON_K_SMT_2d92_alt  [CON-001-SMA-ST - duplicate]
J_DIG_2G  CON_K_SMT_2d92  [CON_K_SMT_2D92_3]
J_DRX  CON_K_SMT_2d92  [CON_K_SMT_2D92_3]
J_MAINQUAD_IN  02K80F-40ML5  [CONN_02K80F-40ML5_RBG]
J_MEMCLK_IN  CON_K_SMT_2d92  [CON_K_SMT_2D92_3]
J_MEMOUT  CON_K_SMT_2d92  [CON_K_SMT_2D92_3]
J_RINGOUT  CON_K_SMT_2d92  [CON_K_SMT_2D92_3]

### Ports
CLKQUAD_8G (in, see BoardTop[7D]), CLKQUAD_16G (in, see BoardTop[7D]), CLKQUAD_CLKIN (out, see BoardTop[7C]), MAINQUAD_1G_OUT (out, see BoardTop[7C]), MAINQUAD_CLKIN (out, see BoardTop[7C]), MAINQUAD_RING_OUT (out, see BoardTop[7C]), Q4_CLK_2G (in, see BoardTop[7D]), Q4_DRX_OUT (in, see BoardTop[7D], Intel16_UNI3[3A], Intel16_UNI3_Q4[1A]), Q4_MEM_CLK (out, see BoardTop[7D]), Q4_MEM_OUT (in, see BoardTop[7D], FPGA_connector[3A], Intel16_UNI3[3A], Intel16_UNI3_Q4[1A])

### Nets
GND: J_8G.1(GND) J_8G.2(GND) J_8G.4(GND) J_16G.1(GND) J_16G.2(GND) J_16G.4(GND) J_ANA_1G.1(GND) J_ANA_1G.2(GND) J_ANA_1G.4(GND) J_CLKQUAD_IN.2(GND) J_CLKQUAD_IN.3(GND) J_DIG_2G.1(GND) J_DIG_2G.2(GND) J_DIG_2G.4(GND) J_DRX.1(GND) J_DRX.2(GND) J_DRX.4(GND) J_MAINQUAD_IN.2 J_MAINQUAD_IN.3 J_MEMCLK_IN.1(GND) J_MEMCLK_IN.2(GND) J_MEMCLK_IN.4(GND) J_MEMOUT.1(GND) J_MEMOUT.2(GND) J_MEMOUT.4(GND) J_RINGOUT.1(GND) J_RINGOUT.2(GND) J_RINGOUT.4(GND)
CLKQUAD_8G: J_8G.3 ; port CLKQUAD_8G
CLKQUAD_16G: J_16G.3 ; port CLKQUAD_16G
CLKQUAD_CLKIN: J_CLKQUAD_IN.1 ; port CLKQUAD_CLKIN
MAIN_1G_OUT: J_ANA_1G.3 ; port MAINQUAD_1G_OUT
MAIN_RING_OUT: J_RINGOUT.3 ; port MAINQUAD_RING_OUT
MAINQUAD_CLKIN: J_MAINQUAD_IN.1 ; port MAINQUAD_CLKIN
Q4_CLK_2G_CAPOUT: J_DIG_2G.3 ; port Q4_CLK_2G
Q4_DRX_OUT: J_DRX.3 ; port Q4_DRX_OUT
Q4_MEM_CLK: J_MEMCLK_IN.3 ; port Q4_MEM_CLK
Q4_MEM_OUT: J_MEMOUT.3 ; port Q4_MEM_OUT

### Layout directives
net class SE50: CLKQUAD_CLKIN, MAIN_1G_OUT, MAIN_RING_OUT, MAINQUAD_CLKIN, Q4_CLK_2G_CAPOUT, Q4_DRX_OUT, Q4_MEM_CLK, Q4_MEM_OUT
net class SC50_Ver2: CLKQUAD_8G, CLKQUAD_16G

### Notes on the sheet
- RF Connectors
- Kunmo Kim

### Library data of the parts
J_8G J_16G J_ANA_1G J_DIG_2G J_DRX J_MEMCLK_IN J_MEMOUT J_RINGOUT = CON_K_SMT_2d92: Con RF K
J_CLKQUAD_IN = CON_K_SMT_2d92_alt: Con RF K
J_MAINQUAD_IN = 02K80F-40ML5: No Description Available; Mfr_Name: Rosenberger; RefDes: RefDes; Type: Type

## Nets that join several sheets
AVDD_P1V1: LDOs (19 pins), AUX_CurrentSource (ABUF_OFFN.1 ABUF_OFFP.1 CTLE_OFFN.1 CTLE_OFFP.1)
GND: BoardTop (14 pins), LDOs (238 pins), LDO_AUX (52 pins), AUX_OPAMP (27 pins), AUX_CurrentSource (29 pins), AA_CLK_16G (10 pins), Decap_Banks (55 pins), FPGA_connector (60 pins), I2C_Multiplexer (8 pins), AA_CLKQUAD_16G (10 pins), RF_Connectors (28 pins)
XAVDD_N2V5: LDOs (8 pins), LDO_AUX (9 pins), AUX_OPAMP (6 pins), AUX_CurrentSource (34 pins)
XAVDD_P2V5: LDOs (9 pins), LDO_AUX (7 pins), AUX_OPAMP (8 pins), AUX_CurrentSource (13 pins)
XDVDD_P2V5: LDOs (8 pins), LDO_AUX (J_DP2V5.1 U_P2V5_LDO.5), AUX_OPAMP (ADC_2.13 C4_3.2 J_ADC2_RST.1 R1_3.1), I2C_Multiplexer (I2C_P2V5.1 I2C_P2V5.3)
XDVDD_P3V3: LDOs (37 pins), LDO_AUX (C14_2.2 J_DP3V3.1 U_P3V3_LDO.5), AUX_CurrentSource (C12_4.1 C13_4.1 U_IDAC.13), I2C_Multiplexer (10 pins)
AVDD_EN: LDOs (LDO_AVDD2.22), FPGA_connector (J1_12.37)
AVDD_P2V1: BoardTop (J_AVDD_IN.1 J_AVDD_IN.2 J_AVDD_IN.3 J_AVDD_IN.4), LDOs (8 pins)
BCVDD_P1V1: BoardTop (J_DBG_CTRL0.1 J_DBG_CTRL1.1), LDO_AUX (10 pins), AUX_CurrentSource (CLKQ_IREF8G.2 CLKQ_IREF8G.3 CLKQ_IREF16G.2 CLKQ_IREF16G.3)
CLKQUAD_8G: BoardTop (C3_0.1), RF_Connectors (J_8G.3)
CLKQUAD_16G: BoardTop (C4_0.1), RF_Connectors (J_16G.3)
CLKQUAD_CLKIN: AA_CLKQUAD_16G (U_BALUN_AA_CLKQUAD_16G.8), RF_Connectors (J_CLKQUAD_IN.1)
CLKQUAD_IREF8G: BoardTop (R6_0.1), AUX_CurrentSource (CLKQ_IREF8G.1), Decap_Banks (C1_11.1 D9_11.1)
CLKQUAD_IREF16G: BoardTop (R5_0.1), AUX_CurrentSource (CLKQ_IREF16G.1), Decap_Banks (C18_11.2 D18_11.1)
CVDD_EN: LDOs (LDO_CVDD2.22), FPGA_connector (J1_12.39)
CVDD_P2V1: BoardTop (J_CVDD_IN.1 J_CVDD_IN.2 J_CVDD_IN.3 J_CVDD_IN.4), LDOs (8 pins)
DEBUG_200uA: AUX_CurrentSource (DBG_200U.2 DBG_200U.3), Decap_Banks (C19_11.2 D19_11.1)
DEBUG_500uA: AUX_CurrentSource (DBG_500U.2 DBG_500U.3), Decap_Banks (C2_11.1 D10_11.1)
DVDD_EN: LDOs (LDO_DVDD2.22), FPGA_connector (J1_12.41)
DVDD_P2V1: BoardTop (J_DVDD_IN.1 J_DVDD_IN.2 J_DVDD_IN.3 J_DVDD_IN.4), LDOs (8 pins)
IBIAS_SF: AUX_CurrentSource (R8_4.2), Decap_Banks (C14_11.2 D14_11.1)
IBIAS_TNH1: AUX_CurrentSource (R2_4.2), Decap_Banks (C13_11.2 D13_11.1)
IBIAS_TNH2: AUX_CurrentSource (R13_4.2), Decap_Banks (C15_11.2 D15_11.1)
IBIAS_VTC: AUX_CurrentSource (R16_4.2), Decap_Banks (C16_11.2 D16_11.1)
ICMFB_ABUF: AUX_CurrentSource (R1_4.2), Decap_Banks (C8_11.2 D6_11.1)
ICMFB_CTLE: AUX_CurrentSource (R4_4.2), Decap_Banks (C5_11.2 D3_11.1)
IIN_CASC: AUX_CurrentSource (R12_4.1), Decap_Banks (C12_11.2 D12_11.1)
IIN_CTAT: AUX_CurrentSource (R15_4.2), Decap_Banks (C10_11.2 D8_11.1)
IIN_LVCASC: AUX_CurrentSource (R7_4.1), Decap_Banks (C11_11.2 D11_11.1)
IOFFSETN_ABUF: AUX_CurrentSource (R18_4.1), Decap_Banks (C7_11.2 D5_11.1)
IOFFSETN_CTLE: AUX_CurrentSource (R20_4.1), Decap_Banks (C4_11.2 D2_11.1)
IOFFSETP_ABUF: AUX_CurrentSource (R19_4.1), Decap_Banks (C6_11.2 D4_11.1)
IOFFSETP_CTLE: AUX_CurrentSource (R21_4.1), Decap_Banks (C3_11.2 D1_11.1)
MAIN_1G_OUT: BoardTop (C1_0.2), RF_Connectors (J_ANA_1G.3)
MAIN_RING_OUT: BoardTop (C2_0.2), RF_Connectors (J_RINGOUT.3)
MAINQUAD_CLKIN: AA_CLK_16G (U_BALUN_AA_CLK_16G.8), RF_Connectors (J_MAINQUAD_IN.1)
MAINQUAD_IREF8G: AUX_CurrentSource (R3_4.2), Decap_Banks (C17_11.2 D17_11.1)
MAINQUAD_IREF16G: AUX_CurrentSource (R9_4.2), Decap_Banks (C9_11.2 D7_11.1)
PMB_ALT: LDOs (LDO_AVDD2.3 LDO_CVDD2.3 LDO_DVDD2.3 R4_1.1), FPGA_connector (J1_12.43)
PMB_SCL: LDOs (LDO_AVDD2.4 LDO_CVDD2.4 LDO_DVDD2.4 R3_1.1), I2C_Multiplexer (I2C_MUX.13)
PMB_SDA: LDOs (LDO_AVDD2.5 LDO_CVDD2.5 LDO_DVDD2.5 R2_1.1), I2C_Multiplexer (I2C_MUX.12)
Q4_CLK_2G_CAPOUT: BoardTop (C5_0.2), RF_Connectors (J_DIG_2G.3)
Q4_MEM_CLK: FPGA_connector (CR2_12.2), RF_Connectors (J_MEMCLK_IN.3)
Q4_MEM_OUT: FPGA_connector (CR1_12.2), RF_Connectors (J_MEMOUT.3)
SCL_FPGA: FPGA_connector (J1_12.47), I2C_Multiplexer (I2C_MUX.18)
SCL_P2V5: LDOs (ADC_1.16 R15_1.1), AUX_OPAMP (ADC_2.16), AUX_CurrentSource (U_DPOT_2CH.9 U_DPOT_4CH.14), I2C_Multiplexer (I2C_MUX.6 I2C_P2V5.6)
SCL_P3V3: LDOs (R10_1.1 U_AVDD_POT.4 U_CVDD_POT.4 U_DVDD_POT.2), AUX_CurrentSource (U_IDAC.2), I2C_Multiplexer (I2C_MUX.9 I2C_P3V3.6)
SDA_FPGA: FPGA_connector (J1_12.45), I2C_Multiplexer (I2C_MUX.19)
SDA_P2V5: LDOs (ADC_1.15 R14_1.1), AUX_OPAMP (ADC_2.15), AUX_CurrentSource (U_DPOT_2CH.7 U_DPOT_4CH.9), I2C_Multiplexer (I2C_MUX.5 I2C_P2V5.4)
SDA_P3V3: LDOs (R11_1.1 U_AVDD_POT.5 U_CVDD_POT.5 U_DVDD_POT.3), AUX_CurrentSource (U_IDAC.1), I2C_Multiplexer (I2C_MUX.8 I2C_P3V3.4)
XVDD_INN: BoardTop (J_XVDD_IN_N.1 J_XVDD_IN_N.2 J_XVDD_IN_N.3 J_XVDD_IN_N.4), LDO_AUX (6 pins)
XVDD_INP: BoardTop (J_XVDD_IN_P.1 J_XVDD_IN_P.2 J_XVDD_IN_P.3 J_XVDD_IN_P.4), LDO_AUX (17 pins)